# EAGLE design rekick2016-Flyback-v2-extra-boards (EAGLE 7.7.0)
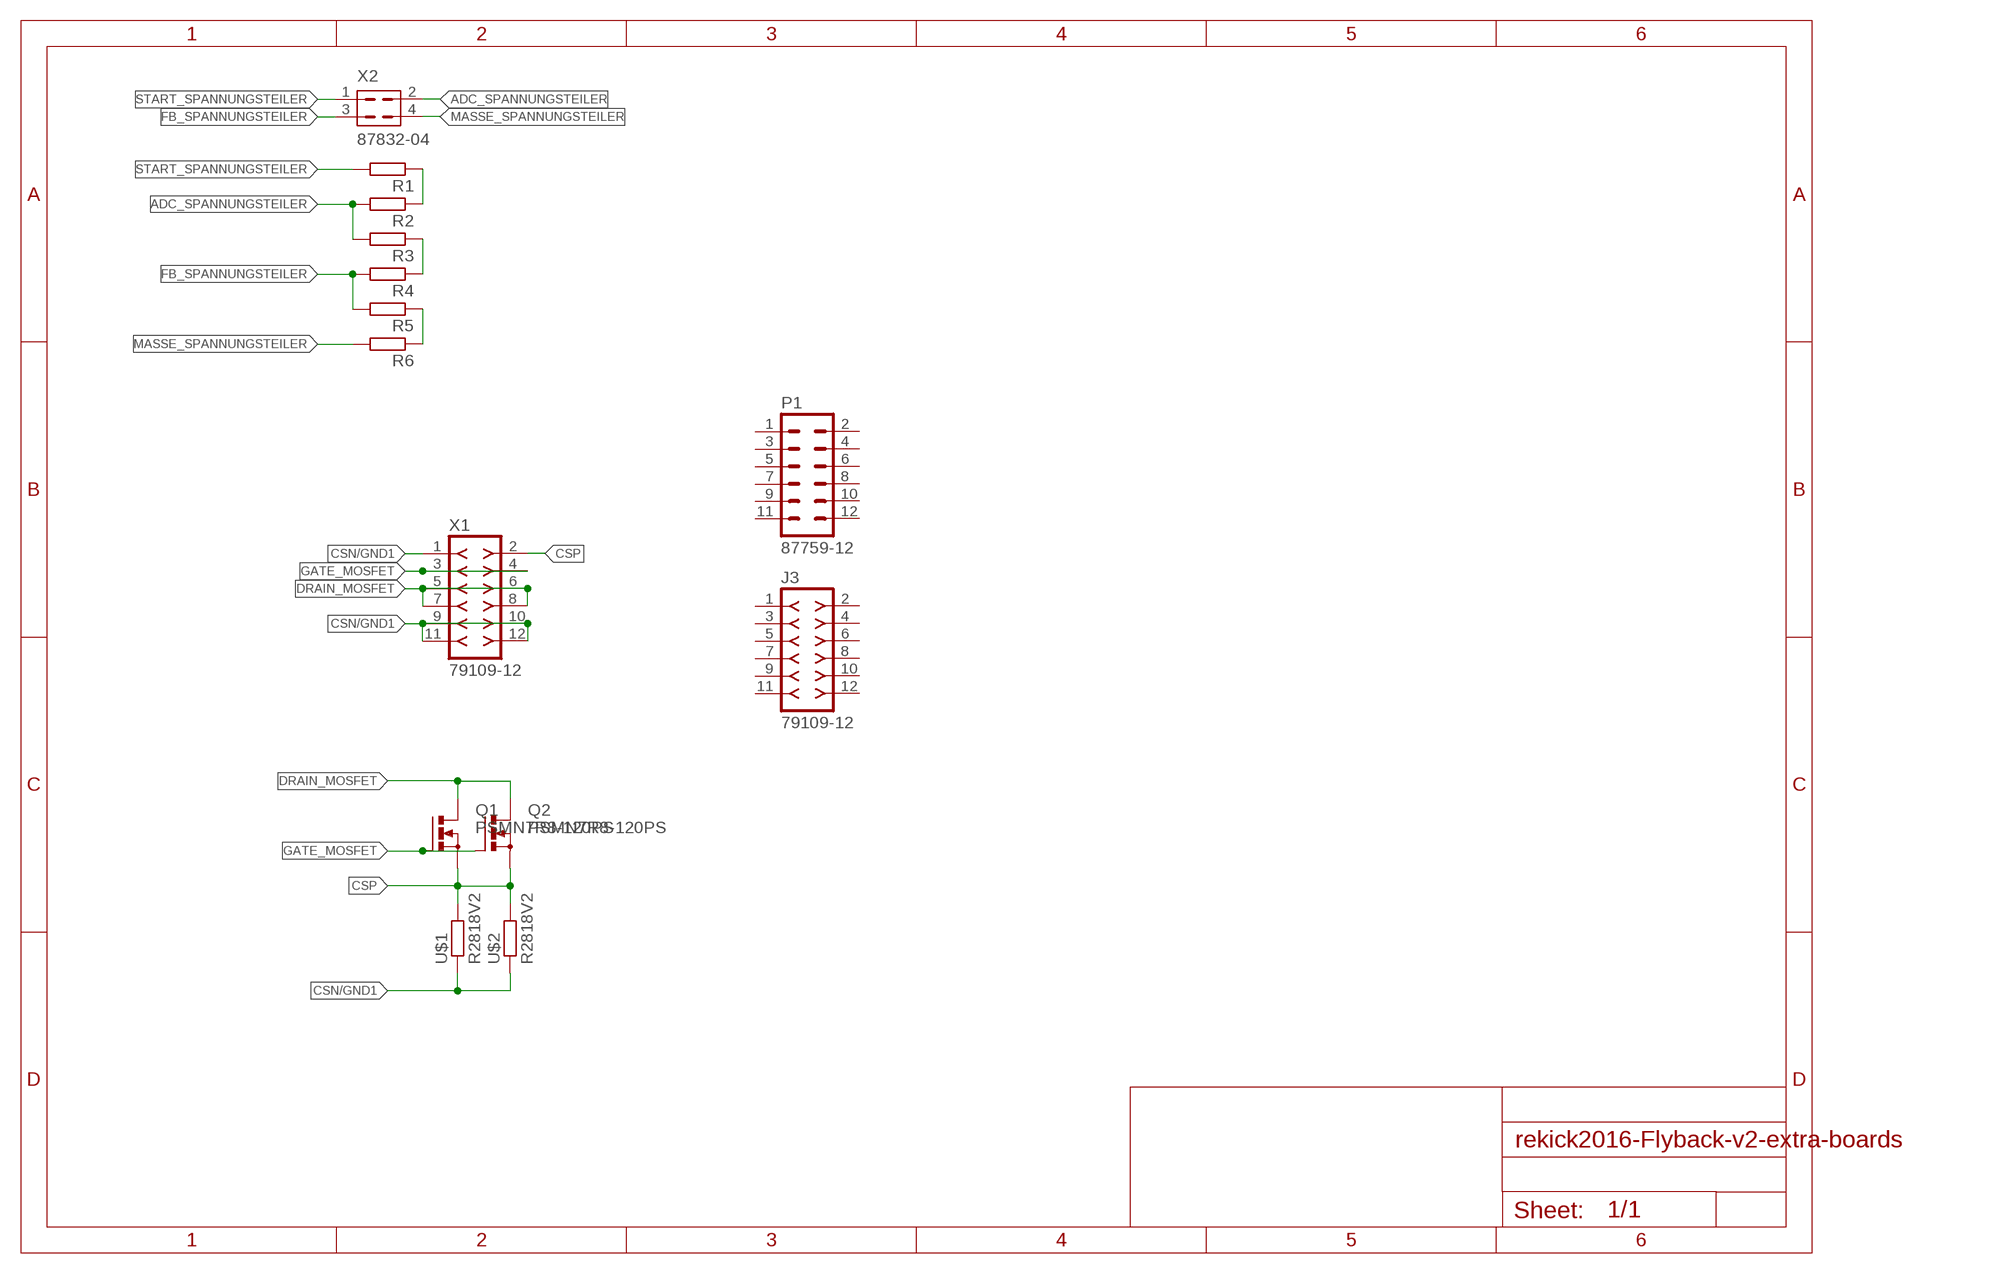
[diagram p0: schematic, sheet 1]

## Parts
J3  79109-12  [79109-12]
P1  87759-12  [87759-12]
Q1  PSMN7R8-120PS  PMOSFET_NTO220BV  [TO220BV]
Q2  PSMN7R8-120PS  PMOSFET_NTO220BV  [TO220BV]
R1  R-EU_R0805  [R0805]
R2  R-EU_R0805  [R0805]
R3  R-EU_R0805  [R0805]
R4  R-EU_R0805  [R0805]
R5  R-EU_R0805  [R0805]
R6  R-EU_R0805  [R0805]
U$1  R2818V2  [R2818]
U$2  R2818V2  [R2818]
X1  79109-12  [79109-12]
X2  87832-04  [87832-04]

## Nets
ADC_SPANNUNGSTEILER: R2.2 R3.2 X2.2
CSN/GND1: U$1.1 U$2.1 X1.1 X1.9 X1.10 X1.11 X1.12
CSP: Q1.S Q2.S U$1.2 U$2.2 X1.2
DRAIN_MOSFET: Q1.D Q2.D X1.5 X1.6 X1.7 X1.8
FB_SPANNUNGSTEILER: R4.2 R5.2 X2.3
GATE_MOSFET: Q1.G Q2.G X1.3 X1.4
MASSE_SPANNUNGSTEILER: R6.2 X2.4
N$1: R1.1 R2.1
N$5: R3.1 R4.1
N$6: R5.1 R6.1
START_SPANNUNGSTEILER: R1.2 X2.1
Unconnected: J3.1 J3.2 J3.3 J3.4 J3.5 J3.6 J3.7 J3.8 J3.9 J3.10 J3.11 J3.12 P1.1 P1.2 P1.3 P1.4 P1.5 P1.6 P1.7 P1.8 P1.9 P1.10 P1.11 P1.12

## Library data of the parts
J3 X1 = con-molex-milli-grid:79109-12: RECEPTACAL
P1 = con-molex-milli-grid:87759-12: HEADER
Q1 Q2 = transistor-power:PMOSFET_N: Power MOSFET N-Channel
R1-R6 = rcl:R-EU_: RESISTOR, European symbol
U$1 U$2 = R2818v2:R2818V2
X2 = con-molex:87832-04: Milli-Grid Header 2.00mm (.079") Pitch; OC_FARNELL: unknown; OC_NEWARK: unknown

## Board
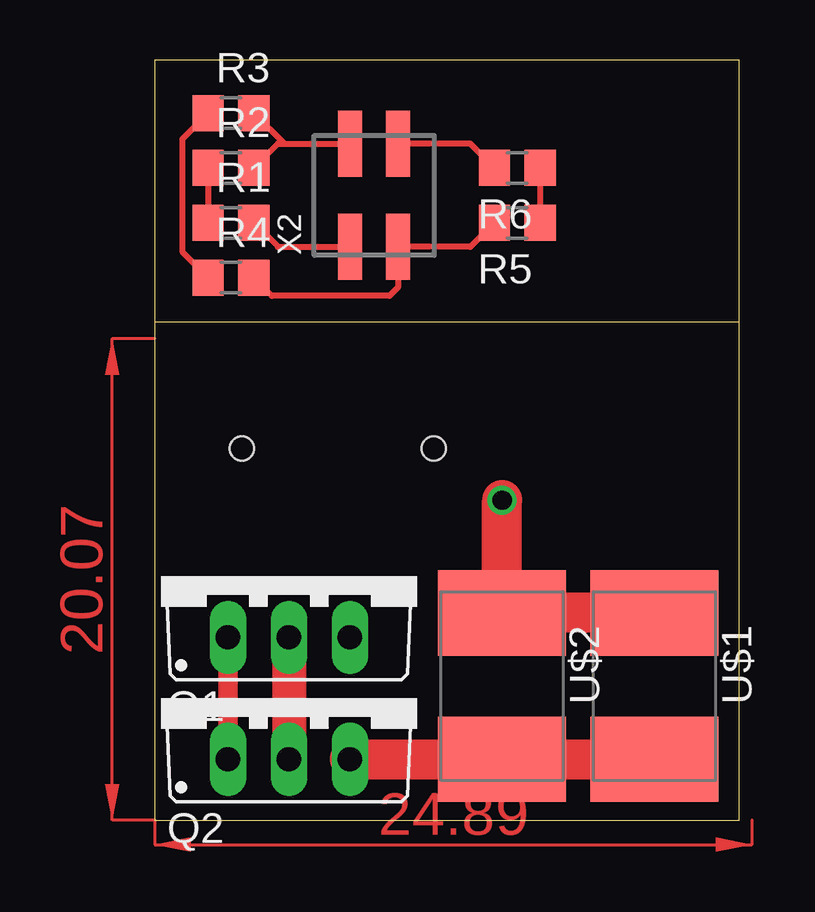
[diagram p1: board, top side]
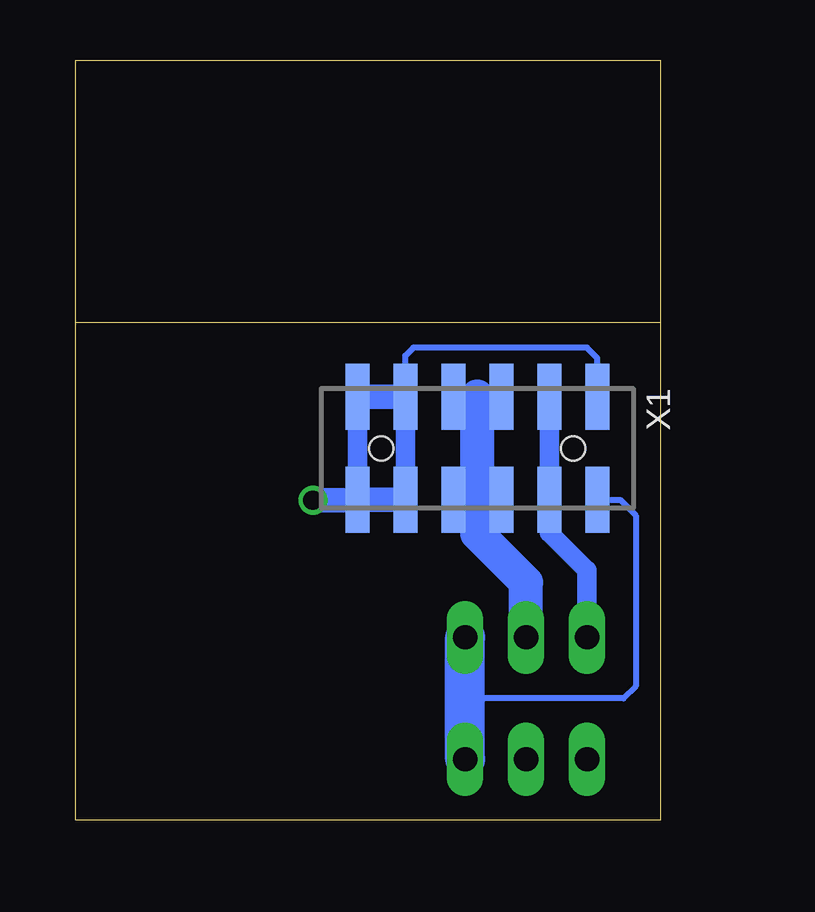
[diagram p2: board, bottom side, seen from below]

Size 24.36 x 31.67 mm. Coordinates in mm from the lower left corner, seen from the top.
Outline: 24.36,20.75 24.36,0 0,0 0,20.75
Outline: 24.36,20.75 24.36,31.67 0,31.67 0,20.75
Outline: 24.36,20.75 0,20.75
Copper layers (1*16): Top 0.035mm / dielectric 1.5mm / Bottom 0.035mm
Design rules "default": minimum track width 10mil, minimum drill 24mil, track to track 8mil, track to pad 8mil, pad to pad 8mil, via to via 8mil, smd to smd 8mil, copper to edge 40mil, drill to drill 8mil, minimum pad ring 10mil, minimum via ring 8mil, stop-mask expansion 4mil, vias tented up to drill 0mil, thermal gap 10mil

### Footprints (pad centres in the part's own frame; a part is rotated, then mirrored left to right if it is on the bottom)
TO220BV = drill 1.016 long: D 0,-2.54; G -2.54,-2.54; S 2.54,-2.54
R0805 = smd 1.3 x 1.5: 1 -0.95,0; 2 0.95,0
R2818 = smd 3.556 x 5.334: 1 -3.048,0; 2 3.048,0
87759-12 = smd 1 x 2.75: 1 -5,-2.15; 2 -5,2.15; 3 -3,-2.15; 4 -3,2.15; 5 -1,-2.15; 6 -1,2.15; 7 1,-2.15; 8 1,2.15; 9 3,-2.15; 10 3,2.15; 11 5,-2.15; 12 5,2.15 | hole 1: -4,0; 4,0
87759-04 = smd 1 x 2.75: 1 -1,-2.15; 2 -1,2.15; 3 1,-2.15; 4 1,2.15

### Placement (x,y rotation side)
Q1  5.59,10.16 0 top
Q2  5.59,5.08 0 top
R1  3.17,24.89 0 top
R2  3.17,27.18 0 top
R3  3.17,29.46 0 top
R4  3.17,22.61 0 top
R5  15.11,24.89 180 top
R6  15.11,27.18 180 top
U$1  20.83,5.59 270 top
U$2  14.48,5.59 270 top
X1  87759-12  [87759-12]  7.62,15.49 180 bottom
X2  87759-04  [87759-04]  9.14,26.04 0 top

### Tracks (layer width: path | path; a pad name or v marks a point on that pad's centre or on a via)
ADC_SPANNUNGSTEILER
  Top 0.254: R2.2 5.13,28.18 5.4,28.18 | 5.4,28.18 X2.2 | R3.2 5.4,28.18
CSN/GND1  (via drill 0.8)
  Top 1.016: 17.65,8.89 17.91,8.64
  Top 1.676: U$1.1 17.91,8.64 U$2.1 v14.48,13.34
  Bottom 0.254: X1.1 2.62,19.26 3.05,19.68 10.29,19.68 10.62,19.35 X1.9
  Bottom 0.813: X1.9 X1.10 | X1.12 12.62,17.57 12.7,17.65
  Bottom 1.016: X1.9 X1.11 | X1.10 X1.12 v14.48,13.34
CSP
  Top 1.676: Q2.S U$2.2 U$1.2
  Bottom 0.254: X1.2 1.66,13.34 1.02,12.7 1.02,5.59 1.52,5.08 8.13,5.08
  Bottom 1.676: Q2.S 8.13,5.08 Q1.S
DRAIN_MOSFET
  Top 1.422: Q1.D Q2.D
  Bottom 0.61: X1.5 6.63,17.65 7.62,17.65 8.61,17.65 X1.7 | X1.6 7.61,13.34 7.62,13.34 7.63,13.34 X1.8
  Bottom 1.422: Q1.D 5.59,9.91 7.62,11.94 7.62,13.34 7.62,17.65
FB_SPANNUNGSTEILER
  Top 0.254: R5.2 13.16,23.89 X2.3 10.14,22.21 9.78,21.84 4.89,21.84 R4.2
GATE_MOSFET
  Top 0.813: Q1.G Q2.G
  Bottom 0.813: X1.3 X1.4 4.62,11.99 3.05,10.41 Q1.G
MASSE_SPANNUNGSTEILER
  Top 0.254: R6.2 13.16,28.18 X2.4
N$1
  Top 0.254: R2.1 R1.1
N$5
  Top 0.254: R3.1 1.14,28.38 1.14,23.69 R4.1
N$6
  Top 0.254: R6.1 R5.1
START_SPANNUNGSTEILER
  Top 0.254: R1.2 5.13,23.89 X2.1
(copper drawn outside any net)
  shapes: Top area x2